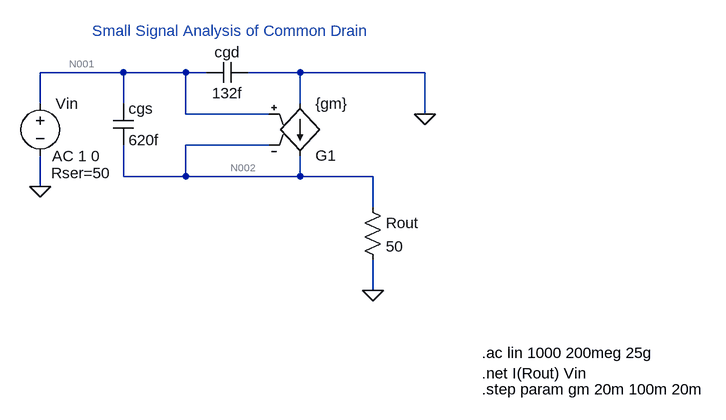
[diagram p0: schematic Small_Signal_Analysis_Common_Drain.asc]
Small_Signal_Analysis_Common_Drain.asc, the LTspice schematic file:
Version 4
SHEET 1 1164 680
WIRE 256 96 128 96
WIRE 352 96 256 96
WIRE 384 96 352 96
WIRE 528 96 448 96
WIRE 720 96 528 96
WIRE 128 144 128 96
WIRE 256 144 256 96
WIRE 528 144 528 96
WIRE 352 160 352 96
WIRE 480 160 352 160
WIRE 720 160 720 96
WIRE 480 208 352 208
WIRE 256 256 256 208
WIRE 352 256 352 208
WIRE 352 256 256 256
WIRE 528 256 528 224
WIRE 528 256 352 256
WIRE 640 256 528 256
WIRE 128 272 128 224
WIRE 640 304 640 256
WIRE 640 432 640 384
FLAG 640 432 0
FLAG 128 272 0
FLAG 720 160 0
SYMBOL voltage 128 128 R0
WINDOW 123 18 97 Left 2
WINDOW 39 17 123 Left 2
SYMATTR Value2 AC 1 0
SYMATTR SpiceLine Rser=50
SYMATTR InstName Vin
SYMATTR Value ""
SYMBOL cap 240 144 R0
SYMATTR InstName cgs
SYMATTR Value 620f
SYMBOL cap 448 80 R90
WINDOW 0 0 32 VBottom 2
WINDOW 3 32 32 VTop 2
SYMATTR InstName cgd
SYMATTR Value 132f
SYMBOL res 624 288 R0
SYMATTR InstName Rout
SYMATTR Value 50
SYMBOL g2 528 240 M180
SYMATTR InstName G1
SYMATTR Value {gm}
TEXT 808 528 Left 2 !.ac lin 1000 200meg 25g\n.net I(Rout) Vin
TEXT 808 584 Left 2 !.step param gm 20m 100m 20m
TEXT 208 32 Left 2 ;Small Signal Analysis of Common Drain

The netlist it stands for:
* Small_Signal_Analysis_Common_Drain.asc
Vin N001 0 AC 1 0 Rser=50
cgs N001 N002 620f
cgd 0 N001 132f
Rout N002 0 50
G1 0 N002 N001 N002 {gm}
.ac lin 1000 200meg 25g
.net I(Rout) Vin
.step param gm 20m 100m 20m
* Small Signal Analysis of Common Drain
.backanno
.end

* Results of the author's LTspice run, read from the files saved beside the schematic
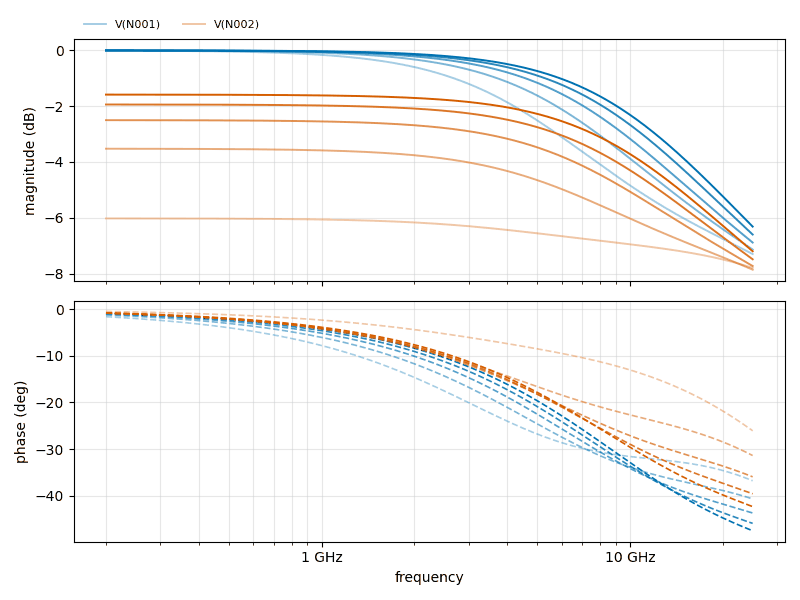
[diagram p1: AC Analysis of Small_Signal_Analysis_Common_Drain.asc, plotted from the saved traces]
* AC Analysis, 5 runs:
*   V(N001) [gm=0.02]: -0.01 dB at 200 MHz, -7.30 dB at 25 GHz, peak -0.01 dB at 200 MHz, 3 dB below the peak at 5.851 GHz
*   V(N001) [gm=0.04]: -0.00 dB at 200 MHz, -7.14 dB at 25 GHz, peak -0.00 dB at 200 MHz, 3 dB below the peak at 7.916 GHz
*   V(N001) [gm=0.06]: -0.00 dB at 200 MHz, -6.89 dB at 25 GHz, peak -0.00 dB at 200 MHz, 3 dB below the peak at 9.595 GHz
*   V(N001) [gm=0.08]: -0.00 dB at 200 MHz, -6.60 dB at 25 GHz, peak -0.00 dB at 200 MHz, 3 dB below the peak at 10.98 GHz
*   V(N001) [gm=0.1]: -0.00 dB at 200 MHz, -6.32 dB at 25 GHz, peak -0.00 dB at 200 MHz, 3 dB below the peak at 12.14 GHz
*   V(N002) [gm=0.02]: -6.02 dB at 200 MHz, -7.80 dB at 25 GHz, peak -6.02 dB at 200 MHz
*   V(N002) [gm=0.04]: -3.52 dB at 200 MHz, -7.86 dB at 25 GHz, peak -3.52 dB at 200 MHz, 3 dB below the peak at 12.75 GHz
*   V(N002) [gm=0.06]: -2.50 dB at 200 MHz, -7.73 dB at 25 GHz, peak -2.50 dB at 200 MHz, 3 dB below the peak at 11.66 GHz
*   V(N002) [gm=0.08]: -1.94 dB at 200 MHz, -7.49 dB at 25 GHz, peak -1.94 dB at 200 MHz, 3 dB below the peak at 12.25 GHz
*   V(N002) [gm=0.1]: -1.58 dB at 200 MHz, -7.20 dB at 25 GHz, peak -1.58 dB at 200 MHz, 3 dB below the peak at 13.02 GHz